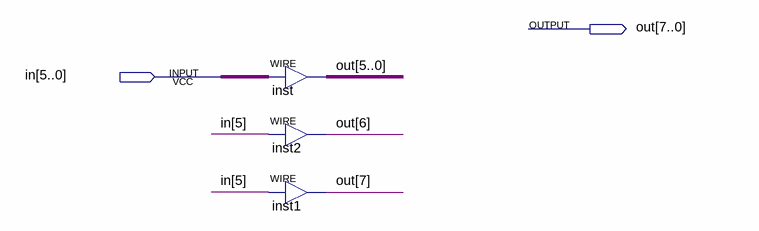
[diagram p0: schematic sheet]
// Quartus schematic sign_extend_6to8.bdf as structural Verilog: 3 symbols, 2 pins
module sign_extend_6to8 (
  input  [5:0] in,
  output [7:0] out
);

  assign out[5:0] = in;  // WIRE inst
  assign out[6] = in[5];  // WIRE inst2
  assign out[7] = in[5];  // WIRE inst1
endmodule
